# EAGLE design Braille Cell (EAGLE 9.6.2)
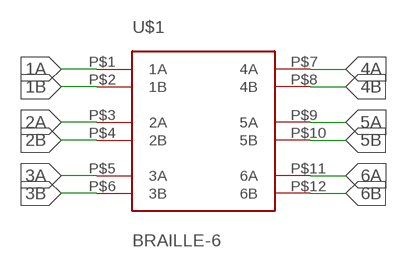
[diagram p0: schematic, sheet 1]

## Parts
U$1  BRAILLE-6  [BRAILLE-6]

## Nets
1A: U$1.P$1(1A)
1B: U$1.P$2(1B)
2A: U$1.P$3(2A)
2B: U$1.P$4(2B)
3A: U$1.P$5(3A)
3B: U$1.P$6(3B)
4A: U$1.P$7(4A)
4B: U$1.P$8(4B)
5A: U$1.P$9(5A)
5B: U$1.P$10(5B)
6A: U$1.P$11(6A)
6B: U$1.P$12(6B)

## Library data of the parts
U$1 = Braille Cell:BRAILLE-6

## Board
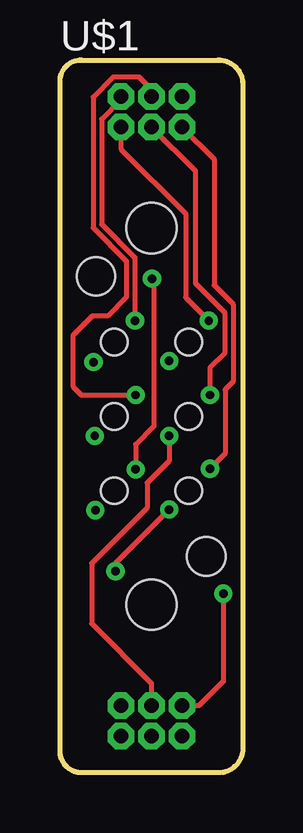
[diagram p1: board, top side]
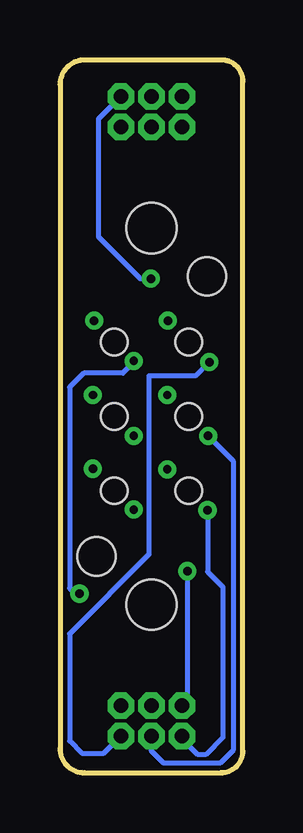
[diagram p2: board, bottom side, seen from below]

Size 7.62 x 29.72 mm. Coordinates in mm from the lower left corner, seen from the top.
Outline: 7.62,28.7 7.62,1.02 arc-90 6.6,0 0.91,0 arc-90 0,0.91 0,28.83 arc-90 0.89,29.72 6.58,29.72 arc-90 7.62,28.7
Copper layers (1*16): Top 0.035mm / dielectric 1.5mm / Bottom 0.035mm
Design rules "default *": minimum track width 6mil, minimum drill 0.35mm, track to track 6mil, track to pad 6mil, pad to pad 6mil, via to via 6mil, smd to smd 6mil, copper to edge 0.2mm, drill to drill 6mil, minimum pad ring 10mil, minimum via ring 8mil, stop-mask expansion 4mil, vias tented up to drill 0mil, thermal gap 10mil
Holes 1.1 mm at 2.26,17.96 5.36,17.96 2.26,14.86 5.36,14.86 2.26,11.76 5.36,11.76
Holes 2.1 mm at 3.81,22.71 3.81,7.01
Holes 1.6 mm at 1.5,20.7 6.1,9.02

### Footprints (pad centres in the part's own frame; a part is rotated, then mirrored left to right if it is on the bottom)
BRAILLE-6 = drill 0.6 octagon: P$1 -1.27,13.335; P$2 1.27,-13.335; P$3 0,13.335; P$4 0,-13.335; P$5 1.27,13.335; P$6 -1.27,-13.335; P$7 -1.27,12.065; P$8 1.27,-12.065; P$9 0,12.065; P$10 0,-12.065; P$11 1.27,12.065; P$12 -1.27,-12.065

### Placement (x,y rotation side)
U$1  3.81,14.86 0 top

### Tracks (layer width: path | path; a pad name or v marks a point on that pad's centre or on a via)
1A  (via drill 0.35)
  Top 0.203: U$1.P$1 2.54,28.07 1.73,27.26 1.73,22.87 3.12,21.48 v3.12,18.85
1B  (via drill 0.35)
  Bottom 0.203: v1.4,17.12 1.41,17.12 1.98,16.55 3.91,16.55 3.91,9.1 7.22,5.79 7.22,1.32 6.71,0.81 5.79,0.81 U$1.P$2
2A  (via drill 0.35)
  Top 0.203: U$1.P$3 3.81,28.5 3.31,29 2.21,29 1.38,28.17 1.38,22.73 2.77,21.34 2.77,19.84 1.98,19.05 1.35,19.05 0.53,18.24 0.53,16.1 0.89,15.75 v3.15,15.75
2B  (via drill 0.35)
  Bottom 0.203: v1.45,14.05 0.4,13 0.4,0.94 0.94,0.4 3.3,0.4 3.81,0.91 U$1.P$4
3A  (via drill 0.35)
  Top 0.203: U$1.P$5 5.21,28.19 | v3.84,20.6 3.91,20.52 3.91,14.45 3.15,13.69 v3.15,12.65
  Bottom 0.203: 3.58,20.6 v3.84,20.6 4.27,20.6 6.02,22.35 6.02,27.25 U$1.P$5
3B  (via drill 0.35)
  Bottom 0.203: v1.47,10.95 1.47,8.38 0.84,7.75 0.84,1.47 1.55,0.76 1.88,0.76 2.54,1.42 U$1.P$6
4A  (via drill 0.35)
  Top 0.203: U$1.P$7 2.54,26.01 5.23,23.32 5.23,19.81 v6.2,18.85
4B  (via drill 0.35)
  Top 0.203: v6.81,7.47 6.81,3.81 5.79,2.79 U$1.P$8
  Bottom 0.203: v6.81,7.47 6.99,7.47 7.22,7.7 7.22,16.07 6.63,16.66 5,16.66 4.55,17.12 v4.55,17.17
5A  (via drill 0.35)
  Top 0.203: U$1.P$9 5.64,25.09 5.64,20.41 6.86,19.19 6.86,17.49 6.25,16.88 v6.25,15.75
5B  (via drill 0.35)
  Top 0.203: v4.55,14.05 4.55,13 3.63,12.09 3.63,11.05 1.32,8.74 1.32,6.22 3.81,3.73 U$1.P$10
6A  (via drill 0.35)
  Top 0.203: U$1.P$11 6.43,25.58 6.43,20.32 7.21,19.54 7.21,16.3 6.88,15.98 6.88,13.31 v6.25,12.68
6B  (via drill 0.35)
  Top 0.203: v4.55,10.97 2.31,8.74 v2.31,8.41
  Bottom 0.203: v2.31,8.41 2.31,3.02 U$1.P$12